# EAGLE design lamp-controller (EAGLE 7.3.0)
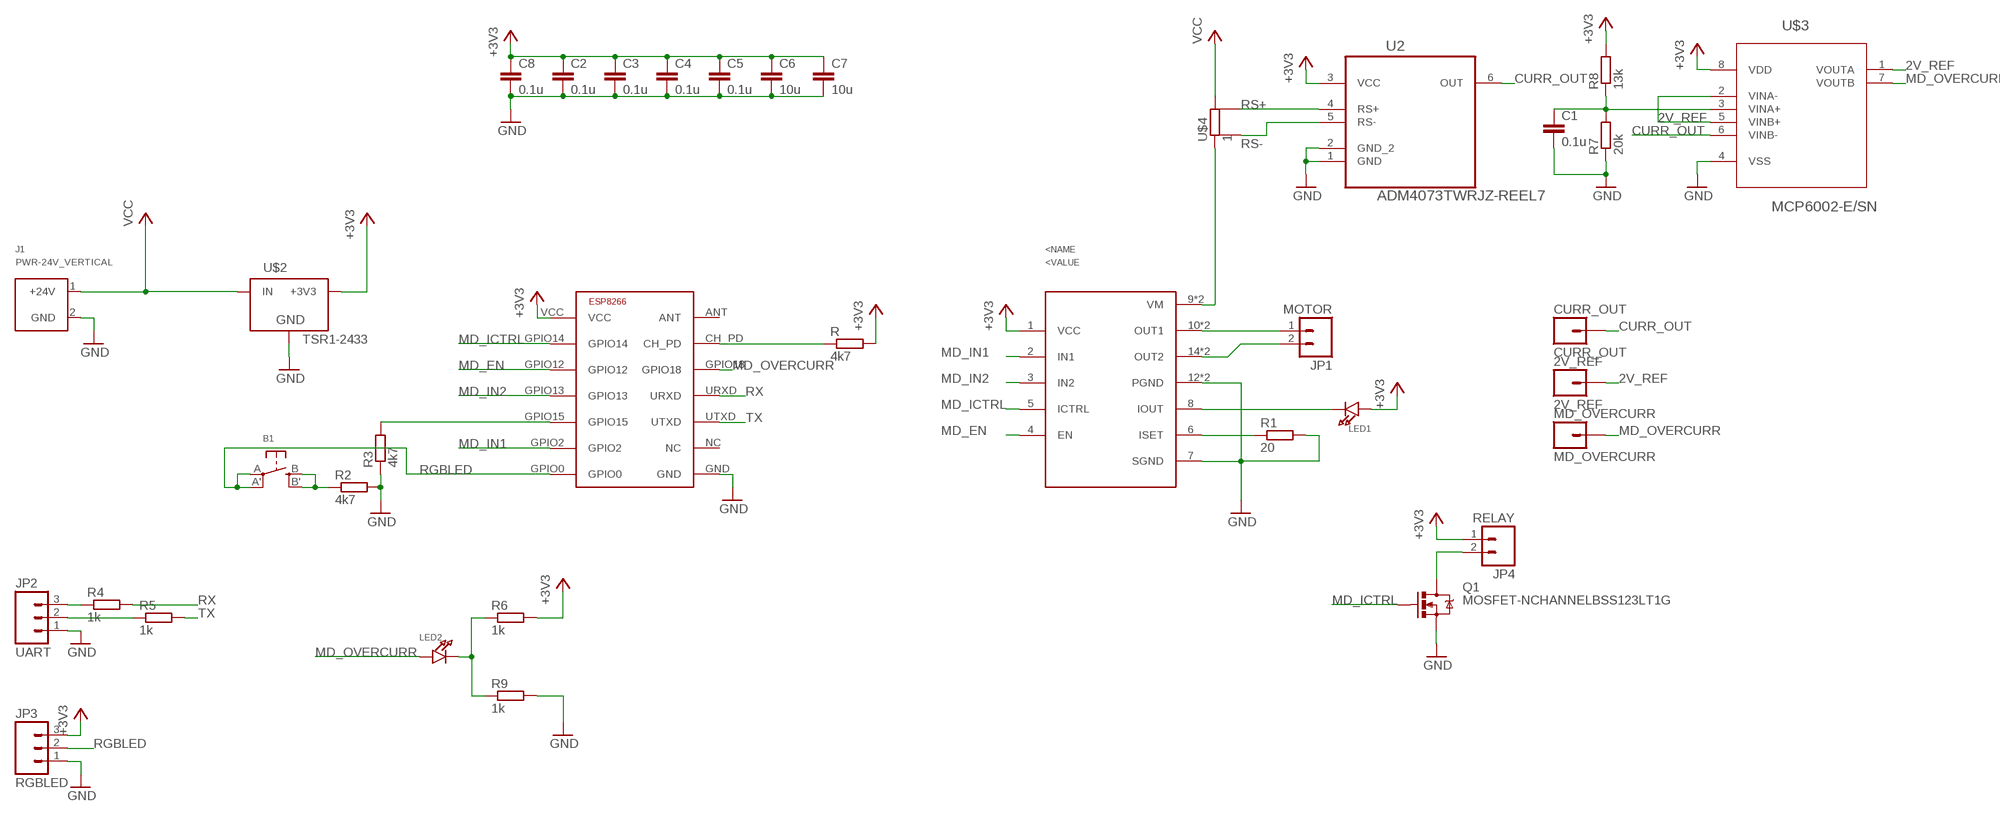
[diagram p0: schematic, sheet 1]

## Parts
2V_REF  2V_REF  M01PTH  [1X01]
B1  SWITCH_TACT_SMT  [EVQ-Q2]
C1  0.1u  C-EUC0805  [C0805]
C2  0.1u  C-EUC0805  [C0805]
C3  0.1u  C-EUC0805  [C0805]
C4  0.1u  C-EUC0805  [C0805]
C5  0.1u  C-EUC0805  [C0805]
C6  10u  C-EUC0805  [C0805]
C7  10u  C-EUC0805  [C0805]
C8  0.1u  C-EUC0805  [C0805]
CURR_OUT  CURR_OUT  M01PTH  [1X01]
J1  PWR-24V_VERTICAL  [PHOENIX-CONTACT-MCV-1,5/2-G-3,81]
JP1  MOTOR  M02PTH  [1X02]
JP2  UART  M03LOCK  [1X03_LOCK]
JP3  RGBLED  M03LOCK  [1X03_LOCK]
JP4  RELAY  M02PTH  [1X02]
LED1  LED1206  [CHIPLED_1206]
LED2  LED1206  [CHIPLED_1206]
MD_OVERCURR  MD_OVERCURR  M01PTH  [1X01]
Q1  MOSFET-NCHANNELBSS123LT1G  [SOT23]
R  4k7  R-EU_R0805  [R0805]
R1  20  R-EU_R0805  [R0805]
R2  4k7  R-EU_R0805  [R0805]
R3  4k7  R-EU_R0805  [R0805]
R4  1k  R-EU_R0805  [R0805]
R5  1k  R-EU_R0805  [R0805]
R6  1k  R-EU_R0805  [R0805]
R7  20k  R-EU_R0805  [R0805]
R8  13k  R-EU_R0805  [R0805]
R9  1k  R-EU_R0805  [R0805]
U1  LV8400V  [TSSOP16]
U2  ADM4073TWRJZ-REEL7  [SOT95P280X145-6N]
U$1  ESP8266-03  [ESP-03]
U$2  TSR1-2433  [TSR-1]
U$3  MCP6002-E/SN  [SOIC127P600X175-8N]
U$4  1  R-EU_CURRSENSE  [R2512]

## Nets
2V_REF: 2V_REF.1 U$3.1(VOUTA) U$3.2(VINA-) U$3.5(VINB+)
+3V3: C2.1 C3.1 C4.1 C5.1 C6.1 C7.1 C8.1 JP3.3 JP4.1 LED1.A R6.2 R8.2 R.2 U1.1(VCC) U2.3(VCC) U$1.VCC U$2.3(+3V3) U$3.8(VDD)
CURR_OUT: CURR_OUT.1 U2.6(OUT) U$3.6(VINB-)
GND: C1.2 C2.2 C3.2 C4.2 C5.2 C6.2 C7.2 C8.2 J1.2(GND) JP2.1 JP3.1 Q1.2(S) R1.2 R2.2 R3.1 R7.1 R9.2 U1.7(SGND) U1.12(PGND) U1.13(PGND) U2.2(GND_2) U$1.GND U$2.2(GND) U$3.4(VSS)
MD_EN: U1.4(EN) U$1.GPIO12
MD_ICTRL: Q1.1(G) U1.5(ICTRL) U$1.GPIO14
MD_IN1: U1.2(IN1) U$1.GPIO2
MD_IN2: U1.3(IN2) U$1.GPIO13
MD_OVERCURR: LED2.A MD_OVERCURR.1 U$1.GPIO18 U$3.7(VOUTB)
N$1: LED1.C U1.8(IOUT)
N$2: R1.1 U1.6(ISET)
N$3: B1.B'(S1) B1.B(S) R2.1
N$4: R3.2 U$1.GPIO15
N$5: JP1.1 U1.10(OUT1) U1.11(OUT1)
N$6: JP1.2 U1.14(OUT2) U1.15(OUT2)
N$7: U1.9(VM) U1.16(VM) U$4.1
N$8: JP2.2 R5.1
N$9: R.1 U$1.CH_PD
N$10: JP2.3 R4.1
N$11: C1.1 R7.2 R8.1 U$3.3(VINA+)
N$12: LED2.C R6.1 R9.1
N$13: JP4.2 Q1.3(D)
RGBLED: B1.A'(P1) B1.A(P) JP3.2 U$1.GPIO0
RS+: U2.4(RS+) U$4.4
RS-: U2.5(RS-) U$4.3
RX: R4.2 U$1.URXD
TX: R5.2 U$1.UTXD
VCC: J1.1(+24V) U$2.1(IN) U$4.2
Unconnected: U2.1(GND) U$1.ANT U$1.NC

## Library data of the parts
2V_REF CURR_OUT MD_OVERCURR = SparkFun-Connectors:M01: Header 1 Standard 1-pin 0.1" header. Use with straight break away headers (SKU : PRT-00116), right angle break away headers (PRT-00553), swiss pins (PRT-00743), machine pins (PRT-00117), and female headers (PRT-00115).
B1 = microbuilder:SWITCH_TACT_SMT: SMT Tact Switches 6x6mm - Digikey: P12940SCT-ND KMR2 (4.6x2.8mm) - Digikey: 401-1426-1-ND EVQ-PQHB55 - Light Touch, 160GF (4.5x4.5mm) - Digikey: P8090SCT-ND
C1-C8 = rcl:C-EU: CAPACITOR, European symbol
J1 = connectors_CleanMobility:PWR-24V
JP1 JP4 = SparkFun-Connectors:M02: Standard 2-pin 0.1" header. Use with - straight break away headers ( PRT-00116) - right angle break away headers (PRT-00553) - swiss pins (PRT-00743) - machine pins (PRT-00117) - female headers (PRT-00115) Molex polarized connector foot print use with: PRT-08233 with associated crimp pins and housings. 2.54_SCREWTERM for use with PRT-10571. 3.5mm Screw Terminal footprints for PRT-08084 5mm Screw Terminal footprints for use with PRT-08432
JP2 JP3 = SparkFun-Connectors:M03: Header 3 Standard 3-pin 0.1" header. Use with straight break away headers (SKU : PRT-00116), right angle break away headers (PRT-00553), swiss pins (PRT-00743), machine pins (PRT-00117), and female headers (PRT-00115). Molex polarized connector foot print use with SKU : PRT-08232 with associated crimp pins and housings.
LED1 LED2 = microbuilder:LED: LED 0603 - 0603 Surface Mount Package 2mA: Green LED - Low Power (3.9mcd, 2ma, 1.7Vf) - Digikey: 475-2709-2-ND Orange LED - Low Power (9.8mcd, 2ma, 1.8Vf) - Digikey: 475-1194-2-ND Red LED - Low Power (5mcd, 2ma, 1.8Vf) - Digikey: 475-1195-2-ND Yellow LED - Low Power (7mcd, 2ma, 1.8Vf) - Digikey: 475-1196-2-ND 5mA: Blue LED - Low Power (17mcd, 5ma, 2.9Vf) - Digikey: LNJ937W8CRACT-ND 0805 - 0805 Surface Mount Package 2mA: Red LED (8.8mcd, 2mA, 1.8Vf, Clear) - Low Power [Digikey: 475-2510-1-ND] Green LED (5mcd, 2mA, 1.8Vf, Clear) - Low Power [Digikey: 475-2730-1-ND] Yellow LED (11.3mcd, 2mA, 1.8Vf, Clear) - Low Power [Digikey: 475-2555-1-ND] 20mA: Red LED (104mcd, 20mA, Diffused) - LS R976 [Digikey: 475-1278-6-ND] Red LED (12mcd, 20mA, 2.0Vf, Clear) - APT2012EC [Digikey: 754-1128-1-ND] Green LED (15mcd, 20mA, 2.2Vf, Clear) - APT2012GC [Digikey: 754-1131-1-ND] Orange LED (160mcd, 20mA, 2.1Vf, Clear) - APT2012SECK [Digikey: 754-1130-1-ND] 1206 - 1206 Surface Mount Package Green LED (26mcd, 20mA, Diffused) - LG N971 [Digikey: 475-1407-6-ND] Red LED (15mcd, 20mA, Diffused) - LH N974 [Digikey: 475-1416-6-ND]
Q1 = SparkFun-DiscreteSemi:MOSFET-NCHANNEL: Common NMOSFET Parts MFG P/N Store ID Prod ID FDD8780 TRANS-09984 SI7820DN TRANS-11055 FDS6630A IC-08089 2N7002PW TRANS-11151 FQP30N06L COM-10213 TRANS-10060 BSS123LT1G TRANS-08345 BSS138 TRANS-00830 BS170 2N7000; PROD_ID: TRANS-08345
R R1-R9 = rcl:R-EU_: RESISTOR, European symbol
U1 = microbuilder:LV8400V
U2 = ADM4073:ADM4073TWRJZ-REEL7: AMP, CURR SENSE, 1.8MHZ, SOT23-6; MPN: ADM4073TWRJZ-REEL7; OC_FARNELL: 2074855; OC_NEWARK: 67W2656; PACKAGE: SOT23-6; SUPPLIER: ANALOG DEVICES
U$1 = ESP8266:ESP8266-03: ESP8266 - ESP-03 Module
U$2 = Traco power:TSR1-2433: Traco Power TSR 1-2433 3.3v switching regulator
U$3 = Microchip_By_element14_Batch_1:MCP6002-E/SN: Low-Power Op Amp; DESCRIPTION: Low-Power Op Amp; MPN: MCP6002-E/SN; OC_FARNELL: 1332118; OC_NEWARK: 34M7473; PACKAGE: SOIC-8; SUPPLIER: Microchip
U$4 = rcl:R-EU_CURRSENSE

## Board
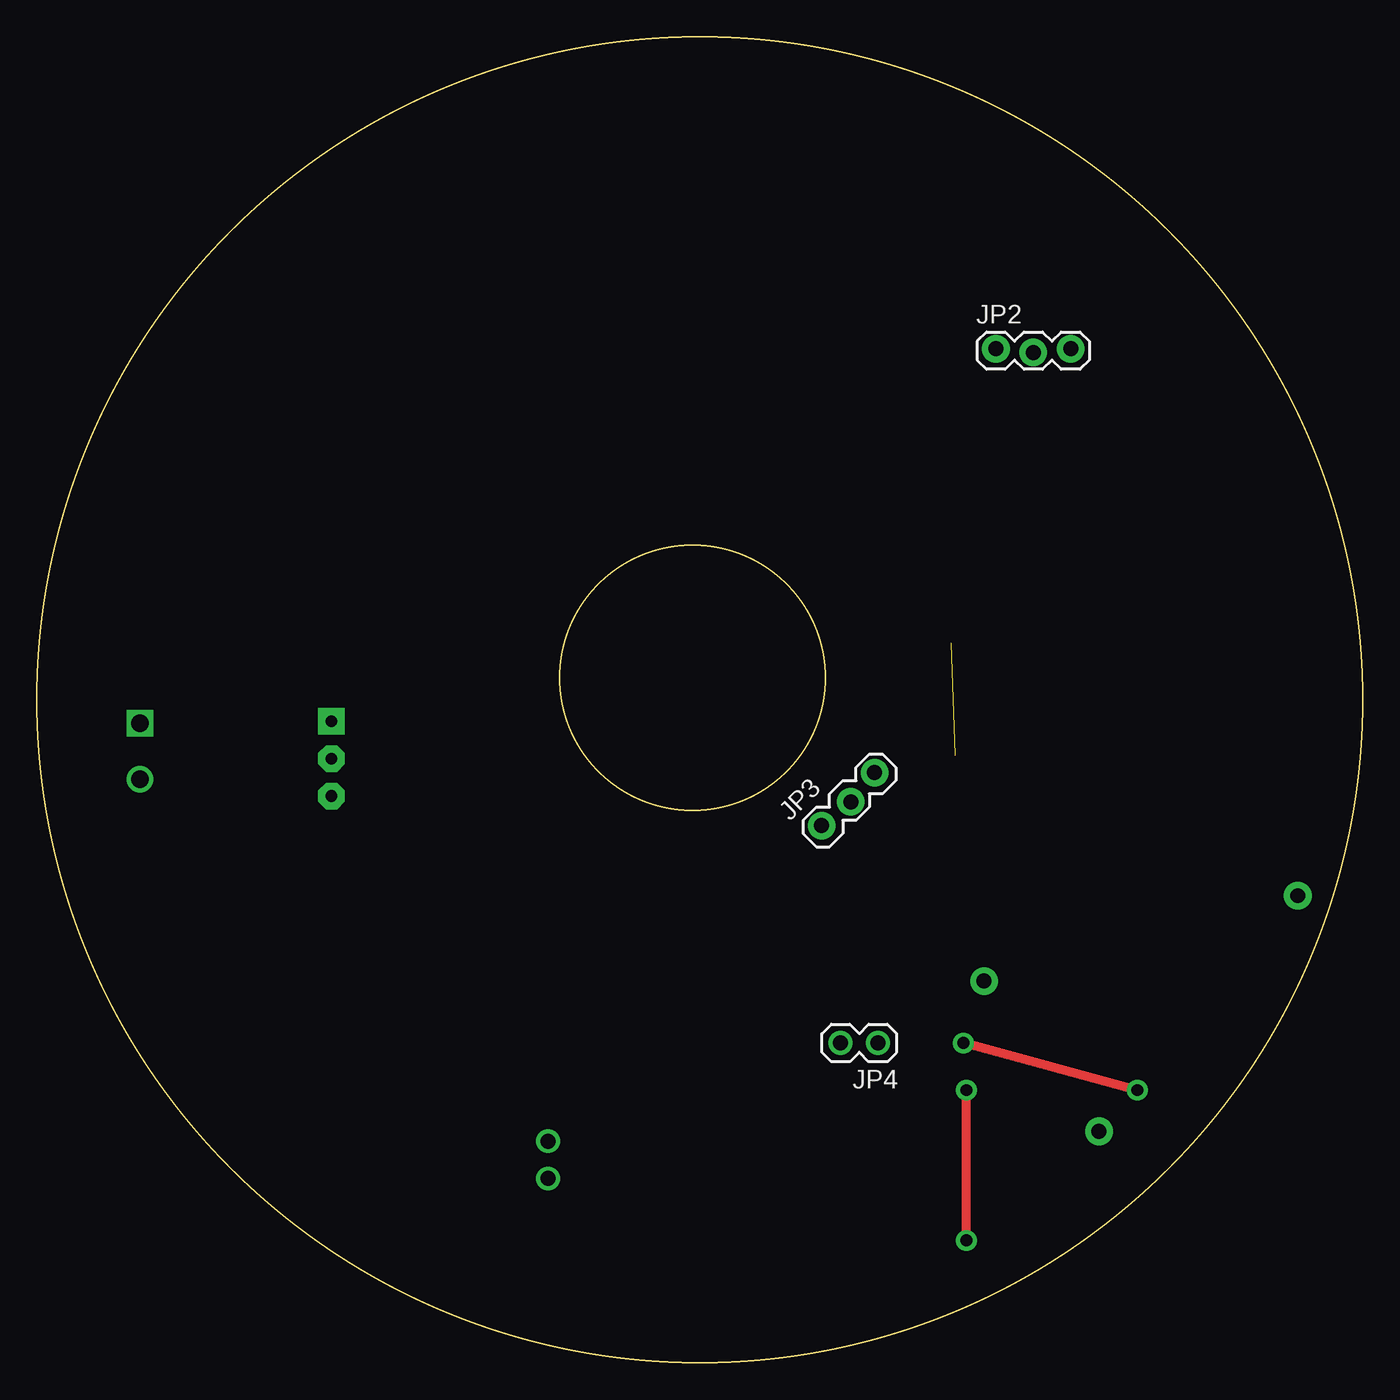
[diagram p1: board, top side]
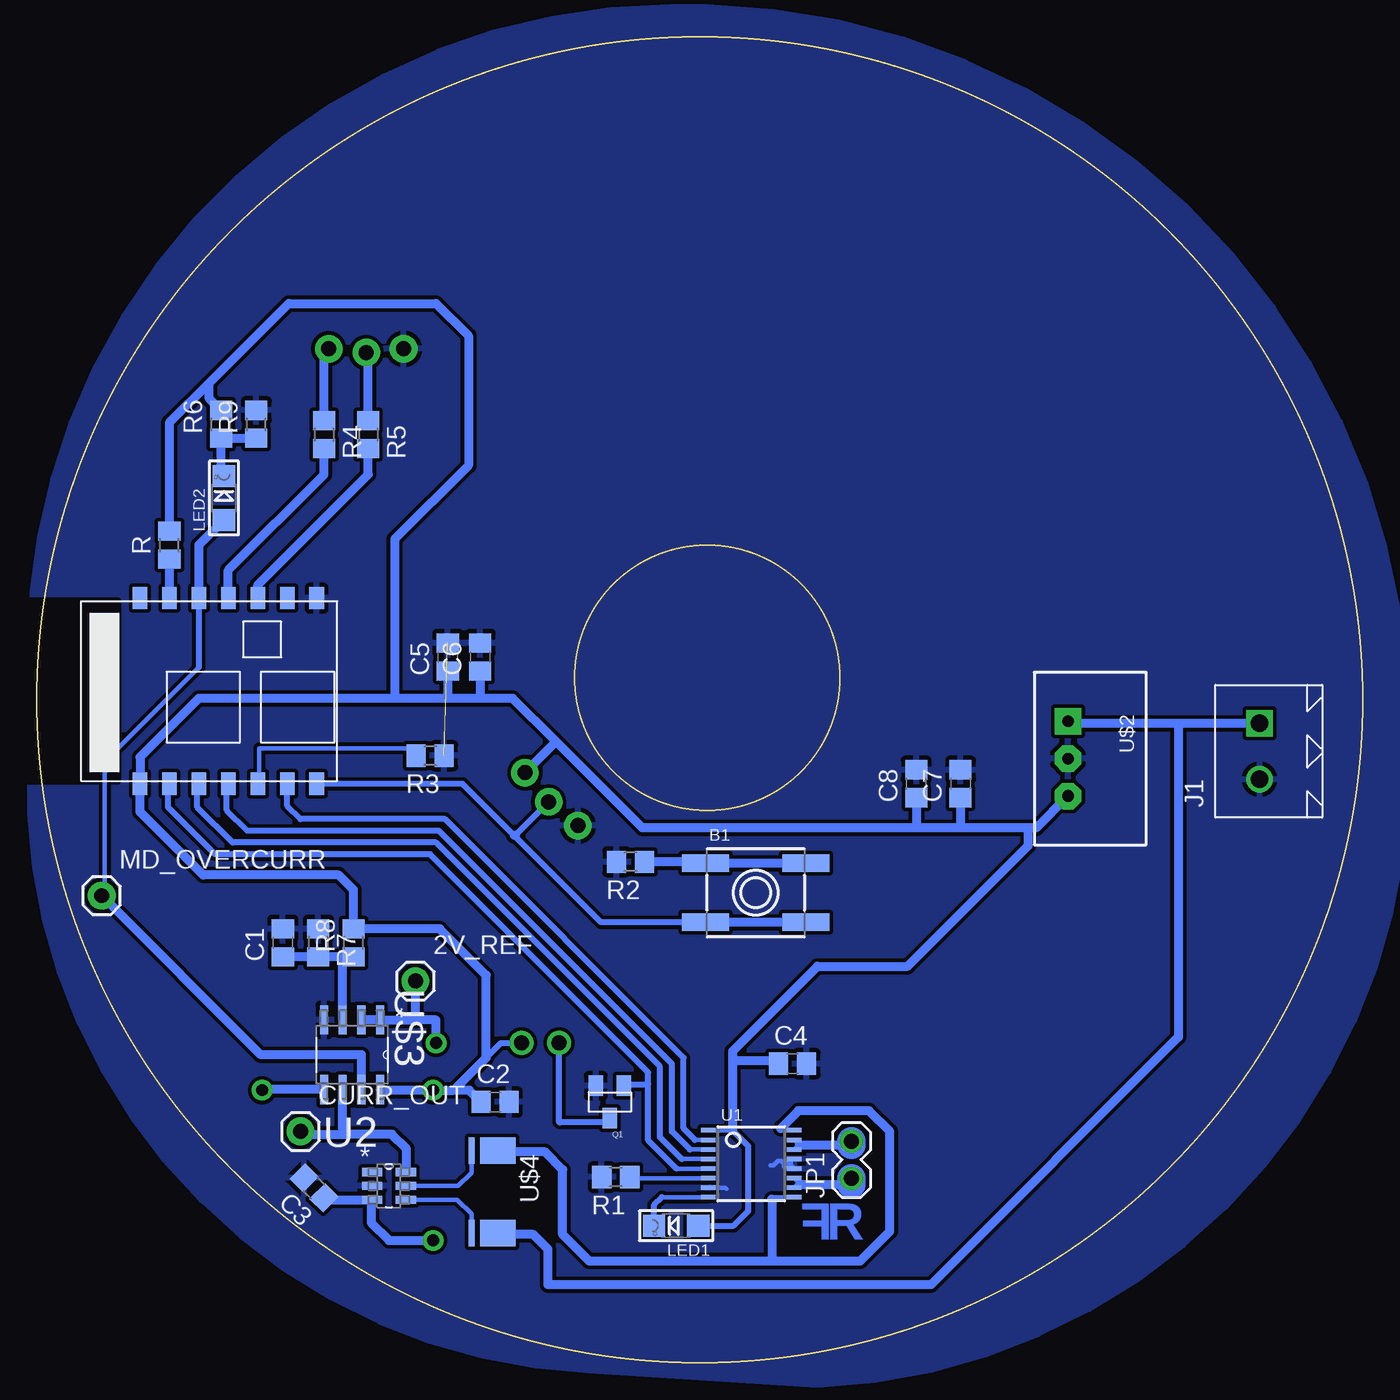
[diagram p2: board, bottom side, seen from below]

Size 90 x 90 mm. Coordinates in mm from the lower left corner, seen from the top.
Outline: circle at 44.5,46.5 radius 9
Outline: circle at 45,45 radius 45
Copper layers (1*16): Top 0.035mm / dielectric 1.5mm / Bottom 0.035mm
Design rules "HVA-LPKF *": minimum track width 0.3mm, minimum drill 0.6mm, track to track 0.25mm, track to pad 0.25mm, pad to pad 0.25mm, via to via 0.25mm, smd to smd 0.25mm, copper to edge 0mil, drill to drill 0.5mm, minimum pad ring 0.3mm, minimum via ring 0.3mm, stop-mask expansion 0.1mm, vias tented up to drill 0mil, thermal gap 0.3mm
bRestrict: area 84.5,39.5 to 91.3,51.7

### Footprints (pad centres in the part's own frame; a part is rotated, then mirrored left to right if it is on the bottom)
1X01 = drill 1.016 pad 1.88: 1 0,0
EVQ-Q2 = smd 3.2 x 1.2: A -3.4,-2; A' 3.4,-2; B -3.4,2; B' 3.4,2
C0805 = smd 1.3 x 1.5: 1 -0.95,0; 2 0.95,0
PHOENIX-CONTACT-MCV-1,5/2-G-3,81 = drill 1.2 square: 1 1.905,-3 | drill 1.2: 2 -1.905,-3
1X02 = drill 1.016 pad 1.524: 1 0,0; 2 2.54,0
1X03_LOCK = drill 1.016 pad 1.88: 1 0,0.127; 2 2.54,-0.127; 3 5.08,0.127
CHIPLED_1206 = smd 1.5 x 1.5: A 0,-1.496; C 0,1.496
SOT23 = smd 1 x 1.4: 1 -0.95,-1.1; 2 0.95,-1.1; 3 0,1.1
R0805 = smd 1.3 x 1.5: 1 -0.95,0; 2 0.95,0
TSSOP16 = smd 0.305 x 0.991: 1 -2.275,-2.918; 2 -1.625,-2.918; 3 -0.975,-2.918; 4 -0.325,-2.918; 5 0.325,-2.918; 6 0.975,-2.918; 7 1.625,-2.918; 8 2.275,-2.918; 9 2.275,2.918; 10 1.625,2.918; 11 0.975,2.918; 12 0.325,2.918; 13 -0.325,2.918; 14 -0.975,2.918; 15 -1.625,2.918; 16 -2.275,2.918
SOT95P280X145-6N = smd 1.372 x 0.559: 1 -1.143,0.94; 2 -1.143,0; 3 -1.143,-0.94; 4 1.143,-0.94; 5 1.143,0; 6 1.143,0.94
ESP-03 = smd 1 x 1.5: ANT 4,12.4; CH_PD 6,12.4; GND 16,12.4; GPIO0 16,-0.2; GPIO2 14,-0.2; GPIO12 8,-0.2; GPIO13 10,-0.2; GPIO14 6,-0.2; GPIO15 12,-0.2; GPIO18 8,12.4; NC 14,12.4; URXD 10,12.4; UTXD 12,12.4; VCC 4,-0.2
TSR-1 = drill 0.8 pad 1.8 square: 1 -2.54,-1.5 | drill 0.8 pad 1.8 octagon: 2 0,-1.5; 3 2.54,-1.5
SOIC127P600X175-8N = smd 1.981 x 0.559: 1 -2.362,1.905; 2 -2.362,0.635; 3 -2.362,-0.635; 4 -2.362,-1.905; 5 2.362,-1.905; 6 2.362,-0.635; 7 2.362,0.635; 8 2.362,1.905
R2512 = smd 1.8 x 2.4: 1 -2.8,0.4; 2 2.8,0.4 | smd 1.8 x 0.4: 3 -2.8,-1.4; 4 2.8,-1.4

### Placement (x,y rotation side)
2V_REF  64.3,25.9 0 bottom
B1  41.2,31.9 0 bottom
C1  73.3,28.5 90 bottom
C2  58.9,17.7 0 bottom
C3  71.18,11.87 135 bottom
C4  38.7,20.3 0 bottom
C5  62.1,47.9 90 bottom
C6  59.9,47.9 90 bottom
C7  27.3,39.3 90 bottom
C8  30.3,39.3 90 bottom
CURR_OUT  72.1,15.7 0 bottom
J1  10,41.5 90 bottom
JP1  34.7,12.5 90 bottom
JP2  65.1,68.7 0 top
JP3  53.37,36.37 45 top
JP4  57.1,21.7 180 top
LED1  46.6,9.3 90 bottom
LED2  77.3,58.7 0 bottom
MD_OVERCURR  85.6,31.7 0 bottom
Q1  51.1,17.7 180 bottom
R  81,55.5 90 bottom
R1  50.7,12.6 180 bottom
R2  49.7,34 180 bottom
R3  63.3,41.2 180 bottom
R4  70.5,63 270 bottom
R5  67.5,63 270 bottom
R6  77.5,63.7 90 bottom
R7  70.9,28.5 270 bottom
R8  68.5,28.5 90 bottom
R9  75.1,63.7 90 bottom
U1  41.5,13.5 270 bottom
U2  66.1,12 0 bottom
U$1  87,39.5 0 bottom
U$2  18.5,41 270 bottom
U$3  68.6,20.9 270 bottom
U$4  59.1,11.6 270 bottom

### Tracks (layer width: path | path; a pad name or v marks a point on that pad's centre or on a via)
2V_REF  (via drill 0.8 pad 1.2)
  Top 0.61: v74.7,18.5 v62.9,21.7
  Bottom 0.61: U$3.2 U$3.1 64.3,23.26 | 64.3,23.26 2V_REF.1 | U$3.5 74.66,18.54 v74.7,18.5 | v62.9,21.7 62.9,23.26 64.3,23.26
+3V3  (via drill 0.8 pad 1.2)
  Top 0.61: v63.1,8.3 v63.1,18.5
  Bottom 0.3: 42.77,15.78 U1.1
  Bottom 0.406: 42.77,15.78 41.7,14.7 41.7,10.3 42.7,9.3 LED1.A | 59.5,20.7 58.5,21.7 JP4.1
  Bottom 0.61: 78.3,66.5 81,63.8 R.2 | 42.77,20.5 42.77,21.14 37.02,26.9 30.9,26.9 22.7,35.1 22.7,36.3 | 42.77,20.5 42.77,15.78 | 22.7,36.3 22.16,36.3 U$2.3 | 22.7,36.3 27.3,36.3 | 27.3,36.3 30.3,36.3 | 30.3,36.3 48.9,36.3 54.9,42.3 | JP3.3 54.9,42.02 54.9,42.3 | R6.2 78.3,65.45 78.3,66.5 | v63.1,8.3 66.1,8.3 67.3,9.5 67.3,11 U2.3 70.38,11.06 C3.1 | 61.7,18.5 v63.1,18.5 66.69,18.5 U$3.8 | 61.7,18.5 59.5,20.7 59.5,26.3 62.65,29.45 R8.2 68.5,32.1 69.5,33.1 78.7,33.1 83,37.4 U$1.VCC 83,41.1 79,45.1 65.9,45.1 | 78.3,66.5 72.9,71.9 62.9,71.9 60.7,69.7 60.7,60.9 65.7,55.9 65.7,45.3 65.9,45.1 | C7.1 27.3,36.3 | C8.1 30.3,36.3 | C4.1 39.85,20.5 42.77,20.5 | C2.1 60.65,18.5 61.7,18.5 | 54.9,42.3 57.7,45.1 59.9,45.1 | 59.9,45.1 62.1,45.1 | 62.1,45.1 65.9,45.1 | C5.1 62.1,45.1 | C6.1 59.9,45.1
CURR_OUT
  Bottom 0.61: U2.6 64.9,13 64.9,14.5 65.9,15.5 68.9,15.5 | 68.9,15.5 69.23,15.84 U$3.6 | CURR_OUT.1 71.9,15.5 68.9,15.5
GND  (1 unrouted)
  Bottom 0.3: U1.12 38.8,13.39 38.8,13.7 38.9,13.6 39,13.6 39,13.4 39.1,13.3 39.3,13.3 39.3,13.6 39.4,13.6 39.5,13.7 39.7,13.7 40,13.4 40.2,13.4 | 43.2,11.8 43.27,11.88 U1.7
  pour Bottom (isolate 0.25): -3,42 arc-90 44.5,92 47,92 arc-90 90.5,48 90.5,41 arc-90 52.5,-0.5 37,-1.5 arc-90
MD_EN
  Bottom 0.3: 79.1,39.2 U$1.GPIO12
  Bottom 0.305: U1.4 46.23,13.82
  Bottom 0.406: 79.1,39.2 79.1,37.7 76.7,35.3 62.9,35.3 47.7,20.1 47.7,15.3 46.23,13.82
MD_ICTRL
  Bottom 0.3: 81.1,39.2 U$1.GPIO14
  Bottom 0.305: 46.58,13.18 U1.5
  Bottom 0.406: 81.1,39.2 81.1,37.7 77.9,34.5 63.3,34.5 48.5,19.7 48.5,18.9 | 46.58,13.18 48.5,15.1 48.5,18.9 | Q1.1 50.05,18.9 48.5,18.9
MD_IN1
  Bottom 0.305: U1.2 45.33,15.12
  Bottom 0.406: 45.33,15.12 46.1,15.9 46.1,20.7 62.3,36.9 72.1,36.9 73,37.8 U$1.GPIO2
MD_IN2
  Bottom 0.3: 77.1,39.2 U$1.GPIO13
  Bottom 0.305: U1.3 45.67,14.47
  Bottom 0.406: 45.67,14.47 46.9,15.7 46.9,20.3 62.7,36.1 75.7,36.1 77.1,37.5 77.1,39.2
MD_OVERCURR
  Bottom 0.3: 79,47.2 85.4,40.8 85.4,31.9 MD_OVERCURR.1
  Bottom 0.406: U$1.GPIO18 79,47.2
  Bottom 0.61: LED2.A 79,55.5 U$1.GPIO18 | U$3.7 67.97,20.9 74.8,20.9 MD_OVERCURR.1
N$1
  Bottom 0.3: LED1.C
  Bottom 0.305: 47.58,11.22 U1.8
  Bottom 0.406: LED1.C 48.1,10.7 47.58,11.22
N$2
  Bottom 0.3: R1.1 49.67,12.53
  Bottom 0.305: 49.67,12.53 U1.6
N$3
  Bottom 0.61: B1.B' B1.B 44.7,34 R2.1
N$4
  Bottom 0.3: U$1.GPIO15 74.9,39.4 74.9,41.7 64.75,41.7 arc90 R3.2
N$5
  Bottom 0.3: U1.10 38.36,12.1 38.16,12.1 U1.11
  Bottom 0.61: 38.16,12.1 34.7,12.1
  Bottom 1.93: 34.7,12.1 JP1.1
N$6
  Bottom 0.3: U1.14 38.26,14.8 U1.15
  Bottom 0.61: 38.26,14.8 34.7,14.8
  Bottom 1.93: 34.7,14.8 JP1.2
N$7
  Bottom 0.3: U1.16 39.17,15.78 39.4,16 | U1.9 39.98,11.22 40.1,11.1
  Bottom 0.61: 40.1,6.9 52.5,6.9 54.3,8.7 54.3,13.1 55.5,14.3 58.6,14.3 U$4.1 | 39.5,15.9 39.4,16 38.3,17.1 33.5,17.1 32.1,15.7 32.1,8.9 34.1,6.9 40.1,6.9 | 40.1,11.1 40.1,6.9
N$8
  Bottom 0.61: R5.1 67.5,68.43 JP2.2
N$9
  Bottom 0.61: R.1 U$1.CH_PD
N$10
  Bottom 0.61: R4.1 70.5,68.51 JP2.3
N$11
  Bottom 0.61: R8.1 69.1,27.55 69.23,27.55 | 69.23,27.55 R7.2 C1.1 | U$3.3 69.23,27.55
N$12
  Bottom 0.61: LED2.C 77.5,60.4 R6.1 R9.1
N$13
  Bottom 0.406: 54.56,20.86 JP4.2 54.56,16.36 54.5,16.3 51.4,16.3 Q1.3
RGBLED
  Bottom 0.406: B1.A 51.7,29.9 57.6,35.8 61.1,39.3 U$1.GPIO0 | JP3.2 57.52,35.8
  Bottom 0.61: B1.A' B1.A | 57.52,35.8 57.6,35.8
RS+
  Bottom 0.3: U$4.4 60.5,10.1 61.46,11.06 U2.4
RS-
  Bottom 0.3: U$4.3 60.5,12.9 61.4,12 U2.5
RX
  Bottom 0.61: U$1.URXD 77,53.8 70.5,60.3 R4.2
TX
  Bottom 0.61: U$1.UTXD 75,52.8 67.5,60.3 R5.2
VCC
  Bottom 0.61: J1.1 12.5,43.41 | 12.5,43.41 12.5,22.1 29.3,5.3 55.3,5.3 55.3,7.7 56.3,8.7 58.6,8.7 U$4.2 | 12.5,43.41 20,43.41 U$2.1

### Text on the board
Bottom: F | R